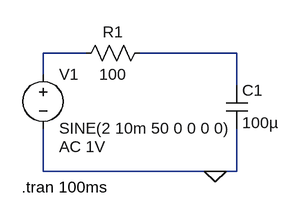
[diagram p0: schematic shunt_capacitor_filter_100uF_ripple.asc]
shunt_capacitor_filter_100uF_ripple.asc, the LTspice schematic file:
Version 4
SHEET 1 880 680
WIRE 176 96 112 96
WIRE 400 96 256 96
WIRE 112 128 112 96
WIRE 400 144 400 96
WIRE 112 272 112 208
WIRE 368 272 112 272
WIRE 400 272 400 208
WIRE 400 272 368 272
FLAG 368 272 0
SYMBOL voltage 112 112 R0
WINDOW 123 24 124 Left 2
WINDOW 39 0 0 Left 0
SYMATTR Value2 AC 1V
SYMATTR InstName V1
SYMATTR Value SINE(2 10m 50 0 0 0 0)
SYMBOL res 272 80 R90
WINDOW 0 0 56 VBottom 2
WINDOW 3 32 56 VTop 2
SYMATTR InstName R1
SYMATTR Value 100
SYMBOL cap 384 144 R0
SYMATTR InstName C1
SYMATTR Value 100µ
TEXT 80 296 Left 2 !.tran 100ms

The netlist it stands for:
* shunt_capacitor_filter_100uF_ripple.asc
V1 N001 0 SINE(2 10m 50 0 0 0 0) AC 1V
R1 N002 N001 100
C1 N002 0 100µ
.tran 100ms
.backanno
.end